# Altium schematic sheet ClockDriver.SchDoc
size A4
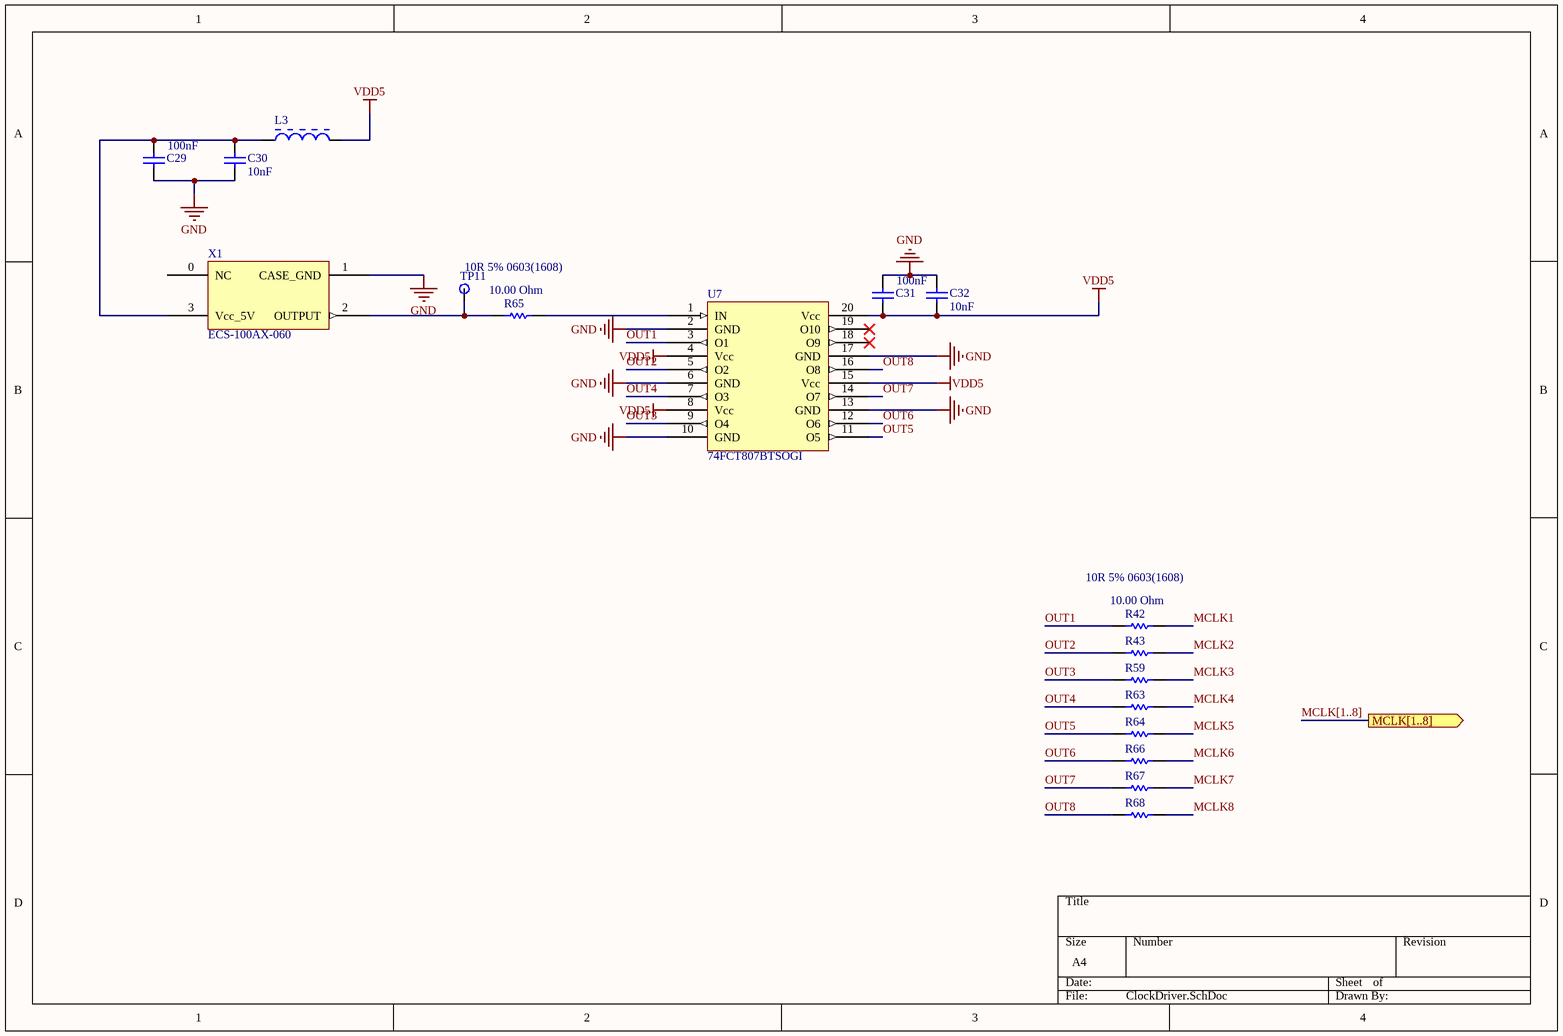
[diagram p0: ClockDriver.SchDoc]

## Parts
C29  value 100nF  [CAPC0603(1608)100_M]  (hidden comment: CAP 100nF 25V 0603(1608))
C30  value 10nF  [CAPC0603(1608)100_N]  (hidden comment: CAP 10nF 25V 0603(1608))
C31  value 100nF  [CAPC0603(1608)100_M]  (hidden comment: CAP 100nF 25V 0603(1608))
C32  value 10nF  [CAPC0603(1608)100_N]  (hidden comment: CAP 10nF 25V 0603(1608))
L3  (no value)  [BOUR-MH1608_V]
R42  10R 5% 0603(1608)  value 10.00 Ohm  [RESC0603(1608)_L]
R43  10R 5% 0603(1608)  [RESC0603(1608)_L]  (value not drawn)
R59  10R 5% 0603(1608)  [RESC0603(1608)_L]  (value not drawn)
R63  10R 5% 0603(1608)  [RESC0603(1608)_L]  (value not drawn)
R64  10R 5% 0603(1608)  [RESC0603(1608)_L]  (value not drawn)
R65  10R 5% 0603(1608)  value 10.00 Ohm  [RESC0603(1608)_L]
R66  10R 5% 0603(1608)  [RESC0603(1608)_L]  (value not drawn)
R67  10R 5% 0603(1608)  [RESC0603(1608)_L]  (value not drawn)
R68  10R 5% 0603(1608)  [RESC0603(1608)_L]  (value not drawn)
TP11  Testpoint  [0603 PROBE PAD]  (value not drawn)
U7  74FCT807BTSOGI  [CLOCK DRIVER 10:1]
X1  ECS-100AX-060  [ECS-100AX-060]

## Ports
MCLK[1..8] (out)

## Nets
GND: C29.2 C30.1 C31.1 C32.2 U7.2(GND) U7.6(GND) U7.10(GND) U7.13(GND) U7.17(GND) X1.1(CASE_GND)
VDD5: C31.2 C32.1 L3.2 U7.4(Vcc) U7.8(Vcc) U7.15(Vcc) U7.20(Vcc)
MCLK1: R42.2
MCLK2: R43.2
MCLK3: R59.2
MCLK4: R63.2
MCLK5: R64.2
MCLK6: R66.2
MCLK7: R67.2
MCLK8: R68.2
OUT1: R42.1 U7.3(O1)
OUT2: R43.1 U7.5(O2)
OUT3: R59.1 U7.9(O4)
OUT4: R63.1 U7.7(O3)
OUT5: R64.1 U7.11(O5)
OUT6: R66.1 U7.12(O6)
OUT7: R67.1 U7.14(O7)
OUT8: R68.1 U7.16(O8)
NetC29_1: C29.1 C30.2 L3.1 X1.3(Vcc_5V)
NetR65_1: R65.1 TP11.0 X1.2(OUTPUT)
NetR65_2: R65.2 U7.1(IN)

Not connected (* = marked no-connect by the designer): U7 18(O9)* 19(O10)*; X1 0(NC)

## Buses and harness runs
bus MCLK[1..8] = port MCLK[1..8]

## Library data of the parts
C29 C31 = CMP-1035-02588-1: CAP 100nF 25V ±10% 0603 (1608 Metric) Thickness 1mm SMD; Case-Metric: 1608; Case-EIA: 0603; Tolerance: Â±10%; Max Thickness: 1 mm; Technology: SMT; Rated Voltage: 25 V; OrderURL: http://www.digikey.ie/product-detail/en/yageo/CC0603KRX7R8BB104/311-1341-1-ND/2103125; Supplier 1: Digi-Key; Supplier Part Number 1: 311-1341-1-ND
C30 C32 = CMP-1035-02317-1: CAP 10nF 25V ±10% 0603 (1608 Metric) Thickness 1mm SMD; Tolerance: Â±10%; Case-Metric: 1608; Case-EIA: 0603; Max Thickness: 1 mm; Rated Voltage: 25 V; Technology: SMT; OrderURL: http://www.digikey.ie/product-detail/en/yageo/CC0603KRX7R8BB103/311-1360-1-ND/2103144; Supplier 1: Digi-Key; Supplier Part Number: 311-1360-1-ND; Supplier Part Number 1: 311-1360-1-ND
L3 = CMP-2000-06698-1: Chip Bead, 600 Ohm, 1 A, -55 to 125 degC, 2-Pin SMD (0603), RoHS, Tape and Reel; Manufacturer: Bourns; Manufacturer Part Number: 742792651; Impedance @ Frequency: 600Ohm@100MHz; DC Resistance (DCR) (Max): 200mOhm; Current Rating (Max): 1A; EDA / CAD Models: DownloadfromAcceleratedDesigns; Filter Type: Power,SignalLine; Number of Lines: 1; Description: FERRITE BEAD 600 OHM 0603 1LN; Mounting Type: SurfaceMount; Package Description: 2-Pin Surface Mount Device, Body 1.6 x 0.8 mm; Category: Filters; Packaging: CutTape(CT); Family: FerriteBeadsandChips; Datasheet Version: 03/2015; Standard Package: 1; Mounting Technology: SurfaceMount; Package / Case: 0603(1608Metric); Datasheet URL: http://www.bourns.com/docs/Product-Datasheets/mh.pdf; Operating Temperature: -55°C~125°C; Ratings: -; Package Reference: 0603; Supplier 1: Digi-Key; Supplier Part Number 1: 732-1593-1-ND; RoHS: RoHS Compliant; Stock 1: 145339; Pricing 1: 1=0.15, 50=0.1546, 100=0.1426, 500=0.13616, 1000=0.12972 (EUR); Part Status: Active; Height (Max): 0.039" (1.00mm); Size / Dimension: 0.063" L x 0.032" W (1.60mm x 0.80mm); ComponentLink1URL: http://katalog.we-online.de/pbs/datasheet/742792651.pdf; ComponentLink1Description: http://katalog.we-online.de/pbs/datasheet/742792651.pdf
R42 R43 R59 R63-R68 = CMP-1012-00026-1: 10R 0.1W 5% 0603 (1608 Metric)  SMD; Manufacturer: Yageo; Manufacturer Part Number: RC0603JR-0710RL; Case-Metric: 1608; Case-EIA: 0603; Description: RES SMD 10 OHM 5% 1/10W 0603; Power (Watts): 0.1W, 1/10W; Temperature Coefficient: ±200ppm/°C; Technology: SMT; Tolerance: 5 %; Power: 0.1 W; Supplier 1: Digi-Key; Supplier Part Number 1: 311-10GRCT-ND; RoHS: RoHS Compliant; Category: Resistors; Stock 1: 1131181; Pricing 1: 1=0.09, 10=0.009, 100=0.004, 1000=0.00178, 2500=0.00155 (EUR); Packaging: Cut Tape (CT); Part Status: Active; Composition: Thick Film; Features: Moisture Resistant; Operating Temperature: -55°C ~ 155°C; Package / Case: 0603 (1608 Metric); Supplier Device Package: 0603; Size / Dimension: 0.063" L x 0.032" W (1.60mm x 0.80mm); Height - Seated (Max): 0.022" (0.55mm); Failure Rate: -; ComponentLink1URL: http://www.yageo.com/documents/recent/PYu-RC_Group_51_RoHS_L_8.pdf; ComponentLink1Description: http://www.yageo.com/documents/recent/PYu-RC_Group_51_RoHS_L_8.pdf
TP11 = Testpoint: 0.063" x 0.031" x 0.045" (1.60mm x 0.80mm x 1.15mm); OrderURL: http://www.digikey.ie/product-detail/en/te-connectivity-amp-connectors/RCU-0C/A106145CT-ND/3477802; Value: *; Width: 0.8; Height: 1.15mm; Length: 1.60mm; Supplier Part Number 1: A106145CT-ND; Supplier 1: Digi-Key
U7 = 74FCT807BTSOGI: IC CLK BUFFER 1:10 100MHZ 20SOIC; Manufacturer: IDT, Integrated Device Technology Inc; Number of Circuits: 1; Differential - Input:Output: No/No; Input: TTL; Voltage - Supply: 4.75 V ~ 5.25 V; Published: 8-Jun-2000; LatestRevisionDate: 29-May-2009; LatestRevisionNote: IPC-7351 Footprint Added.; PackageReference: J1-0603; Publisher: Altium Limited; PackageDescription: Chip Resistor; Manufacturer Part Number: 74FCT807BTSOGI; RoHS: RoHS Compliant; Category: Integrated Circuits (ICs); Packaging: Tube; Part Status: Active; Type: Fanout Buffer (Distribution); Ratio - Input:Output: 1:10; Output: TTL; Frequency - Max: 100MHz; Operating Temperature: -40°C ~ 85°C; Mounting Type: Surface Mount; Package / Case: 20-SOIC (0.295", 7.50mm Width); Supplier Device Package: 20-SOIC; ComponentLink1URL: http://www.idt.com/document/74fct807t-datasheet; ComponentLink1Description: http://www.idt.com/document/74fct807t-datasheet; Supplier 1: Digi-Key; Supplier Part Number 1: 800-3327-5-ND; Stock 1: 281; Pricing 1: 1=3.79, 10=3.384, 25=3.0456, 100=2.7751, 250=2.5044, 500=2.24718, 1000=1.89521, 2500=1.80045, 5000=1.73276 (EUR)
X1 = ECS-100AX-060: OSC XO 6.000MHZ TTL PC PIN; Manufacturer: ECS Inc.; Frequency: 6MHz; Voltage - Supply: 5V; Frequency Stability: ±100ppm; Current - Supply (Max): 15mA; Value: 6Mhz; Published: 8-Jun-2000; LatestRevisionDate: 29-May-2009; LatestRevisionNote: IPC-7351 Footprint Added.; PackageReference: J1-0603; Publisher: Altium Limited; PackageDescription: Chip Resistor; Manufacturer Part Number: ECS-100AX-060; RoHS: RoHS Compliant; Category: Crystals, Oscillators, Resonators; Packaging: Bulk; Part Status: Active; Type: XO (Standard); Function: -; Output: TTL; Operating Temperature: 0°C ~ 70°C; Ratings: -; Mounting Type: Through Hole; Package / Case: 14-DIP, 4 Leads (Full Size, Metal Can); Size / Dimension: 0.821" L x 0.520" W (20.86mm x 13.20mm); Height - Seated (Max): 0.200" (5.08mm); Current - Supply (Disable) (Max): -; ComponentLink1URL: http://www.ecsxtal.com/store/pdf/ecs-100x.pdf; ComponentLink1Description: http://www.ecsxtal.com/store/pdf/ecs-100x.pdf; Supplier 1: Digi-Key; Supplier Part Number 1: X943-ND; Stock 1: 1021; Pricing 1: 1=2.21, 10=2.157, 50=2.054, 100=1.7972, 500=1.74584, 1000=1.48909, 2500=1.3864, 5000=1.33505 (EUR)